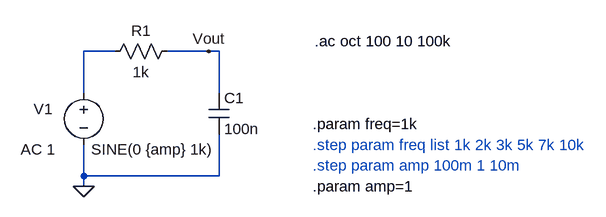
[diagram p0: schematic lab4_1.asc]
lab4_1.asc, the LTspice schematic file:
Version 4
SHEET 1 880 680
WIRE 16 80 -32 80
WIRE 160 80 96 80
WIRE 176 80 160 80
WIRE -32 144 -32 80
WIRE 176 144 176 80
WIRE -32 272 -32 224
WIRE 176 272 176 208
WIRE 176 272 -32 272
WIRE -32 288 -32 272
FLAG -32 288 0
FLAG 160 80 Vout
SYMBOL voltage -32 128 R0
WINDOW 0 -77 41 Left 2
WINDOW 3 11 103 Left 2
WINDOW 123 -97 103 Left 2
WINDOW 39 0 0 Left 2
SYMATTR InstName V1
SYMATTR Value SINE(0 {amp} 1k)
SYMATTR Value2 AC 1
SYMBOL res 112 64 R90
WINDOW 0 0 56 VBottom 2
WINDOW 3 32 56 VTop 2
SYMATTR InstName R1
SYMATTR Value 1k
SYMBOL cap 160 144 R0
SYMATTR InstName C1
SYMATTR Value 100n
TEXT 320 256 Left 2 ;.step param amp 100m 1 10m
TEXT 320 288 Left 2 !.param amp=1
TEXT 323 64 Left 2 !.ac oct 100 10 100k
TEXT 320 224 Left 2 ;.step param freq list 1k 2k 3k 5k 7k 10k
TEXT 320 192 Left 2 !.param freq=1k

The netlist it stands for:
* lab4_1.asc
V1 N001 0 SINE(0 {amp} 1k) AC 1
R1 Vout N001 1k
C1 Vout 0 100n
* .step param amp 100m 1 10m
.param amp=1
.ac oct 100 10 100k
* .step param freq list 1k 2k 3k 5k 7k 10k
.param freq=1k
.backanno
.end

* Results of the author's LTspice run, read from the files saved beside the schematic
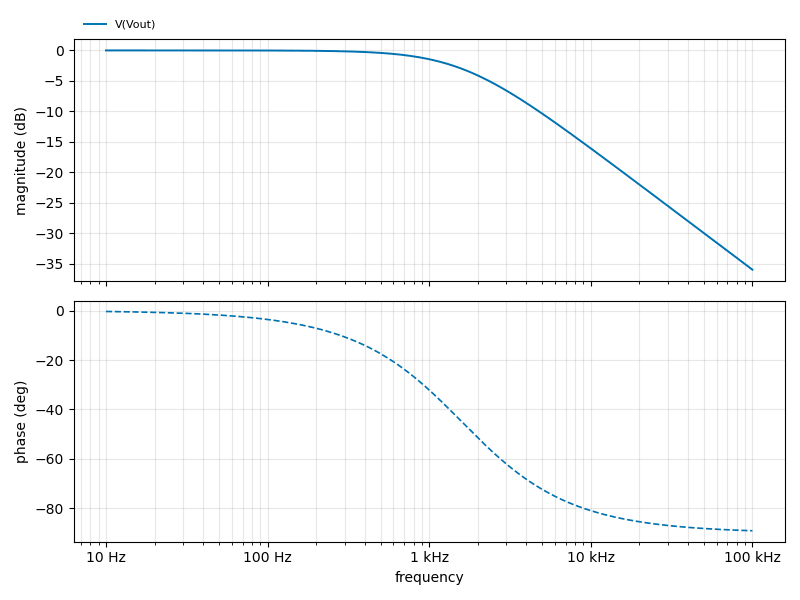
[diagram p1: AC Analysis of lab4_1.asc, plotted from the saved traces]
* AC Analysis, 1 run:
*   V(Vout): -0.00 dB at 10 Hz, -35.96 dB at 100 kHz, peak -0.00 dB at 10 Hz, 3 dB below the peak at 1.592 kHz